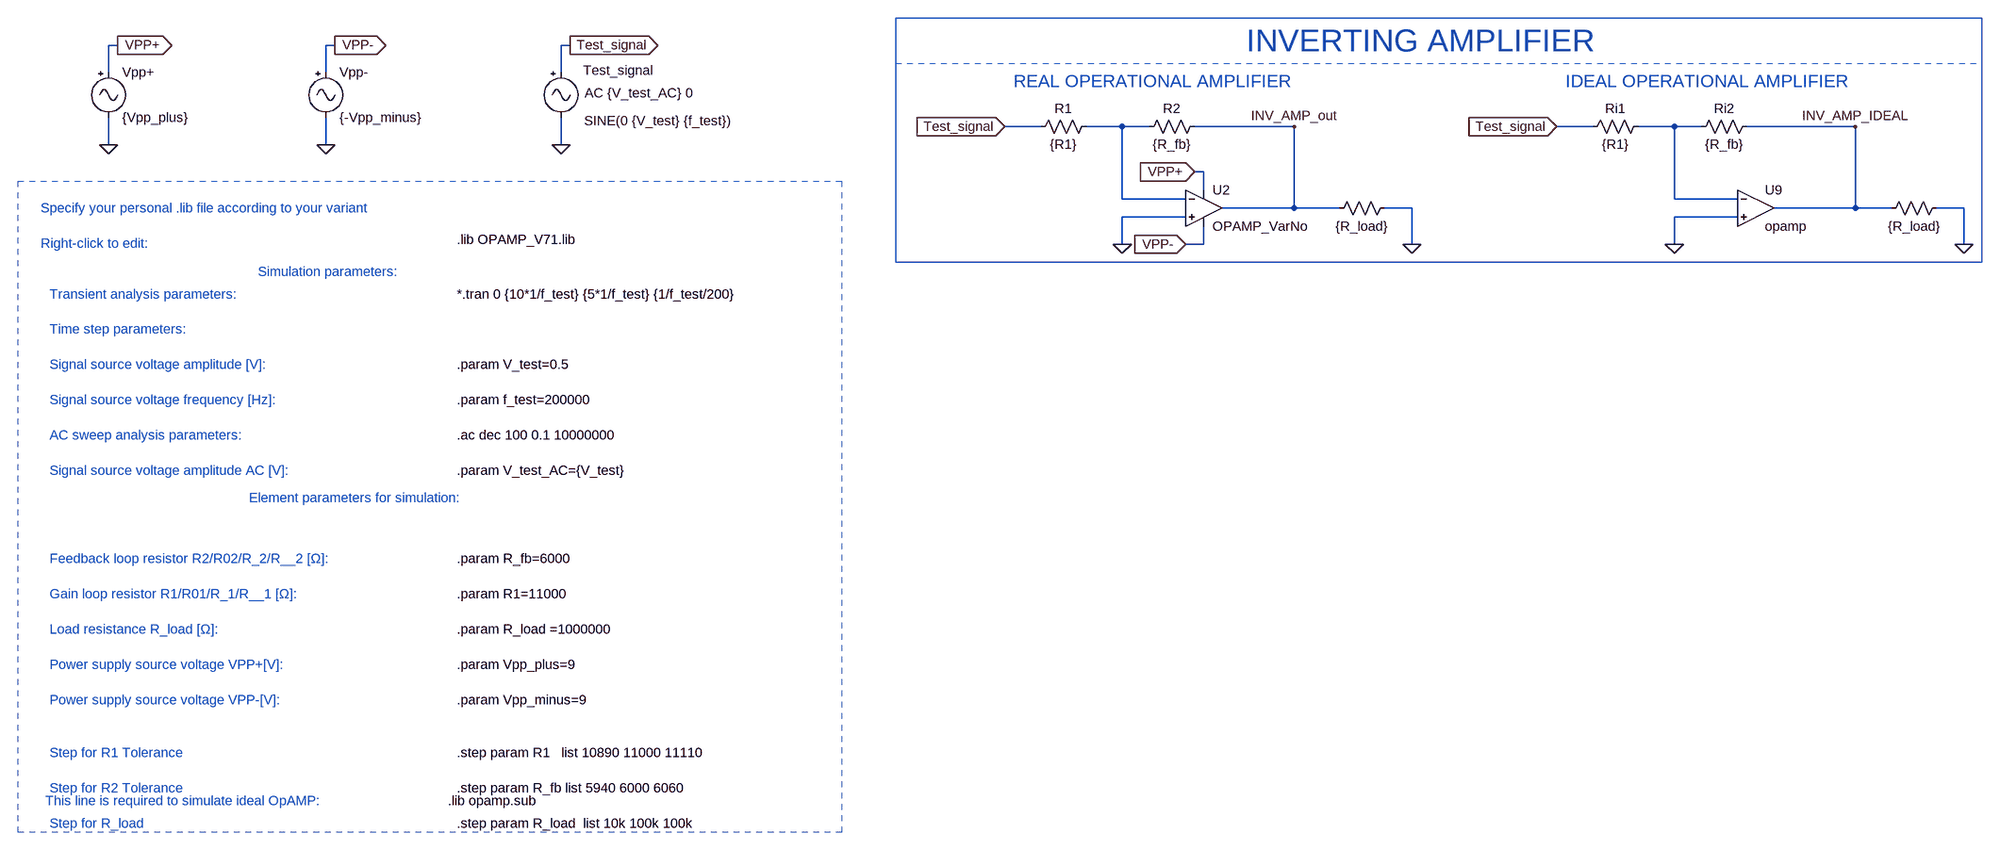
[diagram p0: schematic Lab2. OpAmp.asc]
Lab2. OpAmp.asc, the LTspice schematic file:
Version 4
SHEET 1 3472 2844
WIRE -1632 -880 -1648 -880
WIRE -1248 -880 -1264 -880
WIRE -832 -880 -848 -880
WIRE -1648 -832 -1648 -880
WIRE -1264 -832 -1264 -880
WIRE -848 -832 -848 -880
WIRE 0 -736 -64 -736
WIRE 144 -736 80 -736
WIRE 192 -736 144 -736
WIRE 448 -736 272 -736
WIRE 976 -736 912 -736
WIRE 1120 -736 1056 -736
WIRE 1168 -736 1120 -736
WIRE 1440 -736 1248 -736
WIRE -1648 -704 -1648 -752
WIRE -1264 -704 -1264 -752
WIRE -848 -704 -848 -752
WIRE 288 -656 272 -656
WIRE 288 -624 288 -656
WIRE 144 -608 144 -736
WIRE 256 -608 144 -608
WIRE 1120 -608 1120 -736
WIRE 1232 -608 1120 -608
WIRE 448 -592 448 -736
WIRE 448 -592 320 -592
WIRE 528 -592 448 -592
WIRE 656 -592 608 -592
WIRE 1440 -592 1440 -736
WIRE 1440 -592 1296 -592
WIRE 1504 -592 1440 -592
WIRE 1632 -592 1584 -592
WIRE 256 -576 144 -576
WIRE 1232 -576 1120 -576
WIRE 144 -528 144 -576
WIRE 288 -528 288 -560
WIRE 288 -528 256 -528
WIRE 656 -528 656 -592
WIRE 1120 -528 1120 -576
WIRE 1632 -528 1632 -592
FLAG 144 -528 0
FLAG -1648 -704 0
FLAG -1264 -704 0
FLAG -1632 -880 VPP+
IOPIN -1632 -880 Out
FLAG -1248 -880 VPP-
IOPIN -1248 -880 Out
FLAG 272 -656 VPP+
IOPIN 272 -656 In
FLAG 256 -528 VPP-
IOPIN 256 -528 In
FLAG -848 -704 0
FLAG -832 -880 Test_signal
IOPIN -832 -880 Out
FLAG 448 -736 INV_AMP_out
FLAG -64 -736 Test_signal
IOPIN -64 -736 In
FLAG 1120 -528 0
FLAG 1440 -736 INV_AMP_IDEAL
FLAG 912 -736 Test_signal
IOPIN 912 -736 In
FLAG 656 -528 0
FLAG 1632 -528 0
SYMBOL OpAmps\\opamp2 288 -656 R0
SYMATTR InstName U2
SYMATTR Value OPAMP_VarNo
SYMBOL Misc\\signal -848 -848 R0
WINDOW 123 42 53 Left 2
WINDOW 39 0 0 Left 0
WINDOW 0 39 13 Left 2
WINDOW 3 41 102 Left 2
SYMATTR Value2 AC {V_test_AC} 0
SYMATTR InstName Test_signal
SYMATTR Value SINE(0 {V_test} {f_test})
SYMBOL Misc\\signal -1264 -848 R0
WINDOW 123 0 0 Left 0
WINDOW 39 0 0 Left 0
SYMATTR InstName Vpp-
SYMATTR Value {-Vpp_minus}
SYMBOL Misc\\signal -1648 -848 R0
WINDOW 123 0 0 Left 0
WINDOW 39 0 0 Left 0
SYMATTR InstName Vpp+
SYMATTR Value {Vpp_plus}
SYMBOL res 96 -752 R90
WINDOW 0 0 56 VBottom 2
WINDOW 3 32 56 VTop 2
SYMATTR InstName R1
SYMATTR Value {R1}
SYMATTR SpiceLine tol=10
SYMBOL res 288 -752 R90
WINDOW 0 0 56 VBottom 2
WINDOW 3 32 56 VTop 2
SYMATTR InstName R2
SYMATTR Value {R_fb}
SYMBOL res 1072 -752 R90
WINDOW 0 0 56 VBottom 2
WINDOW 3 32 56 VTop 2
SYMATTR InstName Ri1
SYMATTR Value {R1}
SYMATTR SpiceLine tol=10
SYMBOL res 1264 -752 R90
WINDOW 0 0 56 VBottom 2
WINDOW 3 32 56 VTop 2
SYMATTR InstName Ri2
SYMATTR Value {R_fb}
SYMBOL OpAmps\\opamp 1264 -656 R0
SYMATTR InstName U9
SYMBOL res 624 -608 R90
WINDOW 0 0 56 Invisible 2
WINDOW 3 33 56 VTop 2
SYMATTR InstName R5
SYMATTR Value {R_load}
SYMBOL res 1600 -608 R90
WINDOW 0 0 56 Invisible 2
WINDOW 3 33 56 VTop 2
SYMATTR InstName R7
SYMATTR Value {R_load}
TEXT -1032 -440 Left 2 !*.tran 0 {10*1/f_test} {5*1/f_test} {1/f_test/200}\n \n \n \n.param V_test=0.5\n \n.param f_test=200000\n \n.ac dec 100 0.1 10000000\n \n.param V_test_AC={V_test}\n \n \n  \n  \n.param R_fb=6000\n \n.param R1=11000\n \n.param R_load =1000000\n \n.param Vpp_plus=9\n \n.param Vpp_minus=9\n \n  \n.step param R1   list 10890 11000 11110 \n \n.step param R_fb list 5940 6000 6060\n \n.step param R_load  list 10k 100k 100k
TEXT -1032 -536 Left 2 !.lib OPAMP_V71.lib
TEXT -1768 -592 Left 2 ;Specify your personal .lib file according to your variant\n \nRight-click to edit:
TEXT -1384 -480 Left 2 ;Simulation parameters:
TEXT -1400 -80 Left 2 ;Element parameters for simulation:
TEXT -1752 -440 Left 2 ;Transient analysis parameters:\n \nTime step parameters:\n \nSignal source voltage amplitude [V]:\n \nSignal source voltage frequency [Hz]:\n \nAC sweep analysis parameters:\n \nSignal source voltage amplitude AC [V]:\n  \n \n \n \nFeedback loop resistor R2/R02/R_2/R__2 [Ω]:\n \nGain loop resistor R1/R01/R_1/R__1 [Ω]:\n \nLoad resistance R_load [Ω]:\n \nPower supply source voltage VPP+[V]:\n \nPower supply source voltage VPP-[V]: \n \n \nStep for R1 Tolerance\n \nStep for R2 Tolerance\n \nStep for R_load
TEXT -1048 456 Left 2 !.lib opamp.sub
TEXT 928 -816 Left 3 ;IDEAL OPERATIONAL AMPLIFIER
TEXT -48 -816 Left 3 ;REAL OPERATIONAL AMPLIFIER
TEXT 672 -888 Center 5 ;INVERTING AMPLIFIER
TEXT -1760 456 Left 2 ;This line is required to simulate ideal OpAMP:
RECTANGLE Normal -352 512 -1808 -640 2
RECTANGLE Normal 1664 -496 -256 -848 2
RECTANGLE Normal 1664 -496 -256 -928

The netlist it stands for:
* Lab2. OpAmp.asc
XU2 0 N001 VPP+ VPP- INV_AMP_out OPAMP_VarNo  ; pins In+ In- V+ V- OUT
V§Test_signal Test_signal 0 SINE(0 {V_test} {f_test}) AC {V_test_AC} 0
Vpp- VPP- 0 {-Vpp_minus}
Vpp+ VPP+ 0 {Vpp_plus}
R1 N001 Test_signal {R1} tol=10
R2 INV_AMP_out N001 {R_fb}
Ri1 N002 Test_signal {R1} tol=10
Ri2 INV_AMP_IDEAL N002 {R_fb}
XU9 N002 0 INV_AMP_IDEAL opamp Aol=100K GBW=10Meg  ; pins invin noninvin out
R5 0 INV_AMP_out {R_load}
R7 0 INV_AMP_IDEAL {R_load}
*.tran 0 {10*1/f_test} {5*1/f_test} {1/f_test/200}
.param V_test=0.5
.param f_test=200000
.ac dec 100 0.1 10000000
.param V_test_AC={V_test}
.param R_fb=6000
.param R1=11000
.param R_load =1000000
.param Vpp_plus=9
.param Vpp_minus=9
.step param R1   list 10890 11000 11110
.step param R_fb list 5940 6000 6060
.step param R_load  list 10k 100k 100k
.lib OPAMP_V71.lib
* Specify your personal .lib file according to your variant
* Right-click to edit:
* Simulation parameters:
* Element parameters for simulation:
* Transient analysis parameters:
* Time step parameters:
* Signal source voltage amplitude [V]:
* Signal source voltage frequency [Hz]:
* AC sweep analysis parameters:
* Signal source voltage amplitude AC [V]:
* Feedback loop resistor R2/R02/R_2/R__2 [Ω]:
* Gain loop resistor R1/R01/R_1/R__1 [Ω]:
* Load resistance R_load [Ω]:
* Power supply source voltage VPP+[V]:
* Power supply source voltage VPP-[V]:
* Step for R1 Tolerance
* Step for R2 Tolerance
* Step for R_load
.lib opamp.sub
* IDEAL OPERATIONAL AMPLIFIER
* REAL OPERATIONAL AMPLIFIER
* INVERTING AMPLIFIER
* This line is required to simulate ideal OpAMP:
.backanno
.end